# Altium project LEGO_VL53L1X_Sensor.PrjPcb
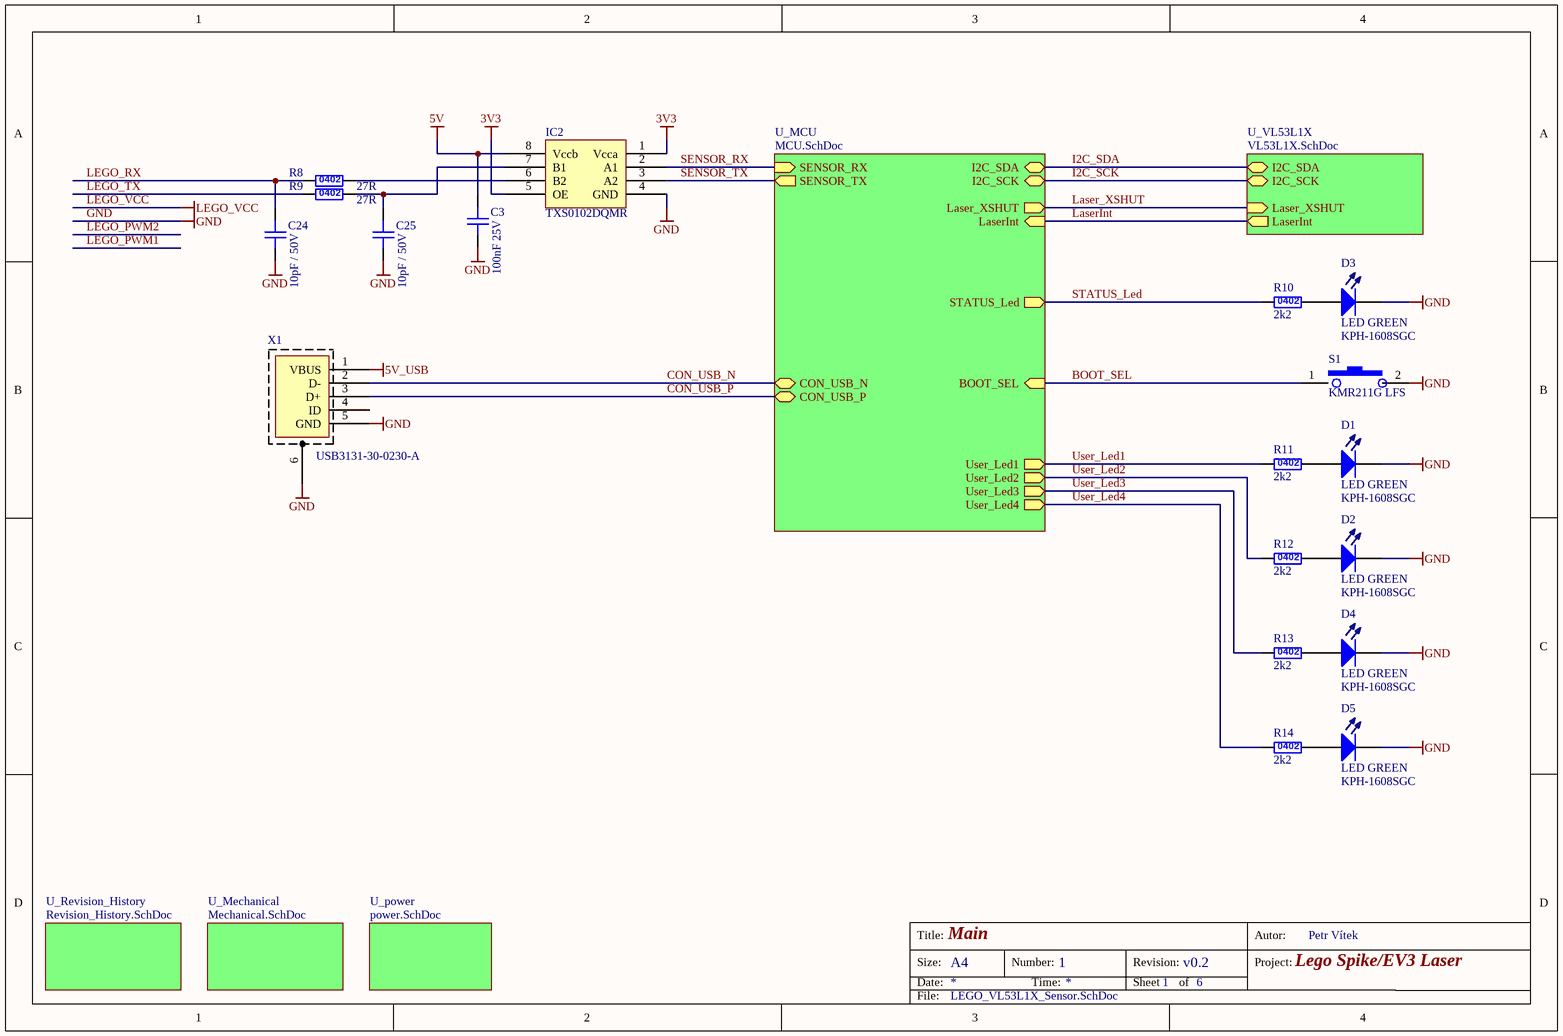
[diagram p0: LEGO_VL53L1X_Sensor.SchDoc]
projectAuthor: Petr Vítek; projectRevision: v0.2; projectTitle: Lego Spike/EV3 Laser
6 sheets, 56 parts. Net scope: hierarchical (ports join the sheet entries above them; power ports are global).
Board file: LEGO_VL53L1X_Sensor.PcbDoc
Sheets:
  LEGO_VL53L1X_Sensor.SchDoc
    U_Revision_History = Revision_History.SchDoc
    U_Mechanical = Mechanical.SchDoc
    U_VL53L1X = VL53L1X.SchDoc
    U_MCU = MCU.SchDoc
    U_power = Power.SchDoc

## Sheet LEGO_VL53L1X_Sensor.SchDoc
size A4; DocumentNumber: 1; SheetNumber: 1; SheetTotal: 6; sheetTitle: Main

### Parts
C3  value 100nF 25V  [C0402]  (hidden comment: UniversalCapacitor)
C24  value 10pF / 50V  [C0402]  (hidden comment: UniversalCapacitor)
C25  value 10pF / 50V  [C0402]  (hidden comment: UniversalCapacitor)
D1  LED GREEN  value KPH-1608SGC  [LED0603]
D2  LED GREEN  value KPH-1608SGC  [LED0603]
D3  LED GREEN  value KPH-1608SGC  [LED0603]
D4  LED GREEN  value KPH-1608SGC  [LED0603]
D5  LED GREEN  value KPH-1608SGC  [LED0603]
IC2  TXS0102DQMR  [X2SON-8_1.8x1.2]
R8  value 27R  [R0402]  (hidden comment: UniversalResistor0402)
R9  value 27R  [R0402]  (hidden comment: UniversalResistor0402)
R10  value 2k2  [R0402]  (hidden comment: UniversalResistor0402)
R11  value 2k2  [R0402]  (hidden comment: UniversalResistor0402)
R12  value 2k2  [R0402]  (hidden comment: UniversalResistor0402)
R13  value 2k2  [R0402]  (hidden comment: UniversalResistor0402)
R14  value 2k2  [R0402]  (hidden comment: UniversalResistor0402)
S1  value KMR211G LFS  [ButtonKMR2]  (hidden comment: PushButton)
X1  value USB3131-30-0230-A  [USB3131-XX-0230-X]  (hidden comment: USB)

### Sub-sheets
U_MCU = MCU.SchDoc: I2C_SDA (bidir), I2C_SCK (bidir), Laser_XSHUT (out), LaserInt (in), SENSOR_TX (out), SENSOR_RX (in), STATUS_Led (out), BOOT_SEL (in), CON_USB_P (bidir), CON_USB_N (bidir), User_Led1 (out), User_Led2 (out), User_Led3 (out), User_Led4 (out)
U_Mechanical = Mechanical.SchDoc: no entries
U_power = power.SchDoc: no entries
U_Revision_History = Revision_History.SchDoc: no entries
U_VL53L1X = VL53L1X.SchDoc: Laser_XSHUT (in), LaserInt (out), I2C_SDA (bidir), I2C_SCK (bidir)

### Nets
3V3: IC2.1(Vcca) IC2.5(OE)
5V: C3.2 IC2.8(Vccb)
5V_USB: X1.1(VBUS)
GND: C3.1 C24.2 C25.2 D1.2(K) D2.2(K) D3.2(K) D4.2(K) D5.2(K) IC2.4(GND) S1.2 X1.5(GND) X1.6
BOOT_SEL: S1.1 ; sheet U_MCU/BOOT_SEL
CON_USB_N: X1.2(D-) ; sheet U_MCU/CON_USB_N
CON_USB_P: X1.3(D+) ; sheet U_MCU/CON_USB_P
I2C_SCK: sheet U_VL53L1X/I2C_SCK, sheet U_MCU/I2C_SCK
I2C_SDA: sheet U_VL53L1X/I2C_SDA, sheet U_MCU/I2C_SDA
Laser_XSHUT: sheet U_VL53L1X/Laser_XSHUT, sheet U_MCU/Laser_XSHUT
LaserInt: sheet U_VL53L1X/LaserInt, sheet U_MCU/LaserInt
LEGO_RX: C24.1 R8.2
LEGO_TX: R9.2
SENSOR_RX: IC2.2(A1) ; sheet U_MCU/SENSOR_RX
SENSOR_TX: IC2.3(A2) ; sheet U_MCU/SENSOR_TX
STATUS_Led: R10.2 ; sheet U_MCU/STATUS_Led
User_Led1: R11.2 ; sheet U_MCU/User_Led1
User_Led2: R12.2 ; sheet U_MCU/User_Led2
User_Led3: R13.2 ; sheet U_MCU/User_Led3
User_Led4: R14.2 ; sheet U_MCU/User_Led4
NetC25_1: C25.1 IC2.7(B1) R9.1
NetD1_1: D1.1(A) R11.1
NetD2_1: D2.1(A) R12.1
NetD3_1: D3.1(A) R10.1
NetD4_1: D4.1(A) R13.1
NetD5_1: D5.1(A) R14.1
NetIC2_6: IC2.6(B2) R8.1

Not connected (* = marked no-connect by the designer): X1 4(ID)

### Notes on the sheet
- Title:
- Size:
- Date:
- A4
- Number:
- Time:
- Revision:
- Sheet
- of
- Autor:
- Project:
- File:
- (in symbol CRCW04022K20FKED) 0402
- (in symbol CRCW040227R0FKED) 0402

### Library data of the parts
C3 = 0402B104K250CT: WALSIN - 0402B104K250CT - CAPACITOR, MLCC, X7R, 0.1UF, 25V, 0402; part_id: 2099; name: 0402B104K250CT; Supplier 1: Farnell; Supplier Part Number 1: 2496772; ComponentLink1URL: http://cz.farnell.com/2496772?Ntt=2496772; HelpURL: http://www.farnell.com/datasheets/2340522.pdf; footprint_name: C0402; schematic_name: UniversalCapacitor
C24 C25 = C0402C100D5GAC: Kategorie produktu:	Vícevrstvé keramické kondenzátory MLCC – pro povrchovou montáž SMD, SMT / Výrobce:	KEMET / RoHS::	V souladu RoHS Údaje / Série:	C-C / Kapacita:	10 pF / Jmenovité napětí (DC) stejnosměrného proudu	:	50 VDC / Dielektrikum:	C0G (NP0) / Tolerance:	0.5 pF / Kód pouzdra - palce:	0402 / Kód pouzdra - mm:	1005 / Výška:	- / Maximální provozní teplota:	+ 125 C / Minimální provozní teplota:	- 55 C / Koncovka:	- / Výrobek:	General Type MLCCs / Obal:	Cut Tape / Obal:	MouseReel / Obal:	Ree; part_id: 2258; name: C0402C100D5GAC; Supplier 1: Mouser; Supplier Part Number 1: 80-C0402C100D5GAC; ComponentLink1URL: https://cz.mouser.com/ProductDetail/KEMET/C0402C100D5GAC/?qs=sGAEpiMZZMu0f%252bT2bkVfuj0aSb%252bMTiHU; HelpURL: http://www.mouser.com/ds/2/212/KEM_C1003_C0G_SMD-1101588.pdf; footprint_name: C0402; schematic_name: UniversalCapacitor
D1-D5 = KPH-1608SGC: KINGBRIGHT - KPH-1608SGC - LED, GREEN, 12MCD, 568NM, SMD LED 0603 zelená; part_id: 980; name: KPH-1608SGC; Supplier 1: Farnell; Supplier Part Number 1: 2426215; ComponentLink1URL: http://cz.farnell.com/2426215?Ntt=2426215; HelpURL: http://www.farnell.com/datasheets/1821279.pdf; footprint_name: LED0603; schematic_name: LED
IC2 = TXS0102DQMR: TEXAS INSTRUMENTS - TXS0102DQMR - Voltage Level Translator, 2 Inputs, 4.2ns, 1.65V to 5.5V, X2SON-8; part_id: 2969; name: TXS0102DQMR; Value: TXS0102DQMR; Supplier 1: Farnell; Supplier Part Number 1: 3050430; ComponentLink1URL: http://cz.farnell.com/3050430?Ntt=3050430; footprint_name: X2SON-8_1.8x1.2; schematic_name: TXS0102DQMR
R8 R9 = CRCW040227R0FKED: VISHAY - CRCW040227R0FKED. - SMD Chip Resistor, 27 ohm, ± 1%, 62.5 mW, 0402 [1005 Metric], Thick Film, General Purpose; name: CRCW040227R0FKED; Supplier 1: Farnell; Supplier Part Number 1: 2140614; ComponentLink1URL: http://cz.farnell.com/2140614?Ntt=2140614; HelpURL: http://www.farnell.com/datasheets/2310790.pdf
R10-R14 = CRCW04022K20FKED: VISHAY - CRCW04022K20FKED. - RES, THICK FILM, 2K2, 1%, 0.063W, 0402; name: CRCW04022K20FKED; Supplier 1: Farnell; Supplier Part Number 1: 2140802; ComponentLink1URL: http://cz.farnell.com/2140802?Ntt=2140802; HelpURL: http://www.farnell.com/datasheets/2310790.pdf
S1 = KMR211G LFS: C & K COMPONENTS - KMR211G LFS - SWITCH, SPST, 0.05A, 32VDC, SMD; part_id: 1256; name: KMR211G LFS; Supplier 1: Farnell; Supplier Part Number 1: 1437635; ComponentLink1URL: http://cz.farnell.com/1437635?Ntt=1437635; HelpURL: http://www.farnell.com/datasheets/1697814.pdf; footprint_name: ButtonKMR2; schematic_name: PushButton
X1 = USB3131-30-0230-A: GCT (GLOBAL CONNECTOR TECHNOLOGY) - USB3131-30-0230-A - USB Connector, Micro USB Type B, USB 2.0, Receptacle, 5 Ways, Through Hole Mount, Vertical; part_id: 2968; Supplier 1: Farnell; ComponentLink1URL: http://cz.farnell.com/2537022?Ntt=2537022; ComponentLink1Description: http://www.farnell.com/datasheets/1359588.pdf; ComponentLink2URL: http://www.adam-tech.com/rick/FinalSingle/CatPg133-134.pdf; ComponentLink2Description: http://www.adam-tech.com/rick/FinalSingle/CatPg133-134.pdf; Pricing: 1=20,954, 100=15,959, 250=14,315, 500=13,066, 1000=12,031 (EUR); Supplier Part Number 1: 2537022; name: USB3131-30-0230-A; HelpURL: http://www.farnell.com/datasheets/2342944.pdf; footprint_name: USB3131-XX-0230-X; schematic_name: MUSB

## Sheet Revision_History.SchDoc
size A4; DocumentNumber: 5; SheetNumber: 5; SheetTotal: 6; PageSetup: Record=PageOptions|CenterHorizontal=True|CenterVertical=True|PrintScale=0.73|XCorrection=1.00|YCorrection=1.00|PrintKind=0|BorderSize=5000000|LeftOffset=0|BottomOffset=0|Orientation=2|PaperLength=1000|PaperWidth=1000|Scale=100|PaperSource=7|PrintQuality=-4|MediaType=1|DitherType=10|PaperKind=A4|PrintScaleMode=1; sheetTitle: Revision history
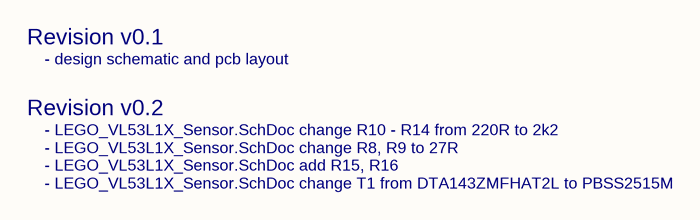
[diagram p1: Revision_History.SchDoc]

### Notes on the sheet
- Revision v0.1
- - design schematic and pcb layout
- Revision v0.2
- - LEGO_VL53L1X_Sensor.SchDoc change R10 - R14 from 220R to 2k2
- - LEGO_VL53L1X_Sensor.SchDoc change R8, R9 to 27R
- - LEGO_VL53L1X_Sensor.SchDoc add R15, R16
- - LEGO_VL53L1X_Sensor.SchDoc change T1 from DTA143ZMFHAT2L to PBSS2515M
- Title:
- Size:
- Date:
- A4
- Number:
- Time:
- Revision:
- Sheet
- of
- Autor:
- Project:
- File:

## Sheet Mechanical.SchDoc
size A4; DocumentNumber: 6; SheetNumber: 6; SheetTotal: 6; sheetTitle: Mechanical

### Notes on the sheet
- Title:
- Size:
- Date:
- A4
- Number:
- Time:
- Revision:
- Sheet
- of
- Autor:
- Project:
- File:

## Sheet VL53L1X.SchDoc
size A4; DocumentNumber: 2; SheetNumber: 2; SheetTotal: 6; sheetTitle: VL53L1X Sensor
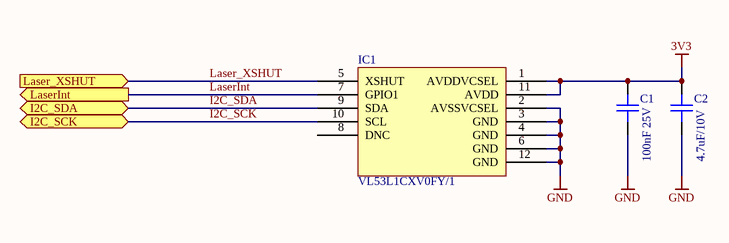
[diagram p2: VL53L1X.SchDoc]

### Parts
C1  value 100nF 25V  [C0402]  (hidden comment: UniversalCapacitor)
C2  4.7uF/10V  [C0402_big]
IC1  value VL53L1CXV0FY/1  [VL53L1X]  (hidden comment: VL53L1X)

### Ports
I2C_SCK (bidir), I2C_SDA (bidir), Laser_XSHUT (in), LaserInt (out)

### Nets
3V3: C1.2 C2.1 IC1.1(AVDDVCSEL) IC1.11(AVDD)
GND: C1.1 C2.2 IC1.2(AVSSVCSEL) IC1.3(GND) IC1.4(GND) IC1.6(GND) IC1.12(GND)
I2C_SCK: IC1.10(SCL) ; port I2C_SCK
I2C_SDA: IC1.9(SDA) ; port I2C_SDA
Laser_XSHUT: IC1.5(XSHUT) ; port Laser_XSHUT
LaserInt: IC1.7(GPIO1) ; port LaserInt

Not connected (* = marked no-connect by the designer): IC1 8(DNC)

### Notes on the sheet
- Title:
- Size:
- Date:
- A4
- Number:
- Time:
- Revision:
- Sheet
- of
- Autor:
- Project:
- File:

### Library data of the parts
C1 = 0402B104K250CT: as C3 on sheet LEGO_VL53L1X_Sensor; name: 0402B104K250CT; Supplier 1: Farnell; Supplier Part Number 1: 2496772; ComponentLink1URL: http://cz.farnell.com/2496772?Ntt=2496772; HelpURL: http://www.farnell.com/datasheets/2340522.pdf; footprint_name: C0402; schematic_name: UniversalCapacitor
C2 = GRM155R61A475MEAAD: MURATA - GRM155R61A475MEAAD - CAP, MLCC, X5R, 4.7UF, 10V, 0402; part_id: 2175; Value: 4.7uF/10V; name: GRM155R61A475MEAAD; Supplier 1: Farnell; Supplier Part Number 1: 2688503; ComponentLink1URL: http://cz.farnell.com/2688503?Ntt=2688503; HelpURL: http://www.farnell.com/datasheets/2189109.pdf; footprint_name: C0402_big; schematic_name: UniversalCapacitor
IC1 = VL53L1CXV0FY/1: STMICROELECTRONICS - VL53L1CXV0FY/1 - Proximity Sensor, I2C, 4000 mm, OLGA, 12 Pins, 2.6 V, 3.5 V; part_id: 2672; name: VL53L1CXV0FY/1; Supplier 1: Farnell; Supplier Part Number 1: 2851946; ComponentLink1URL: http://cz.farnell.com/2851946?Ntt=2851946; HelpURL: http://www.farnell.com/datasheets/2600105.pdf; footprint_name: VL53L1X; schematic_name: VL53L1X

## Sheet MCU.SchDoc
size A4; DocumentNumber: 3; SheetNumber: 3; SheetTotal: 6; sheetTitle: MCU
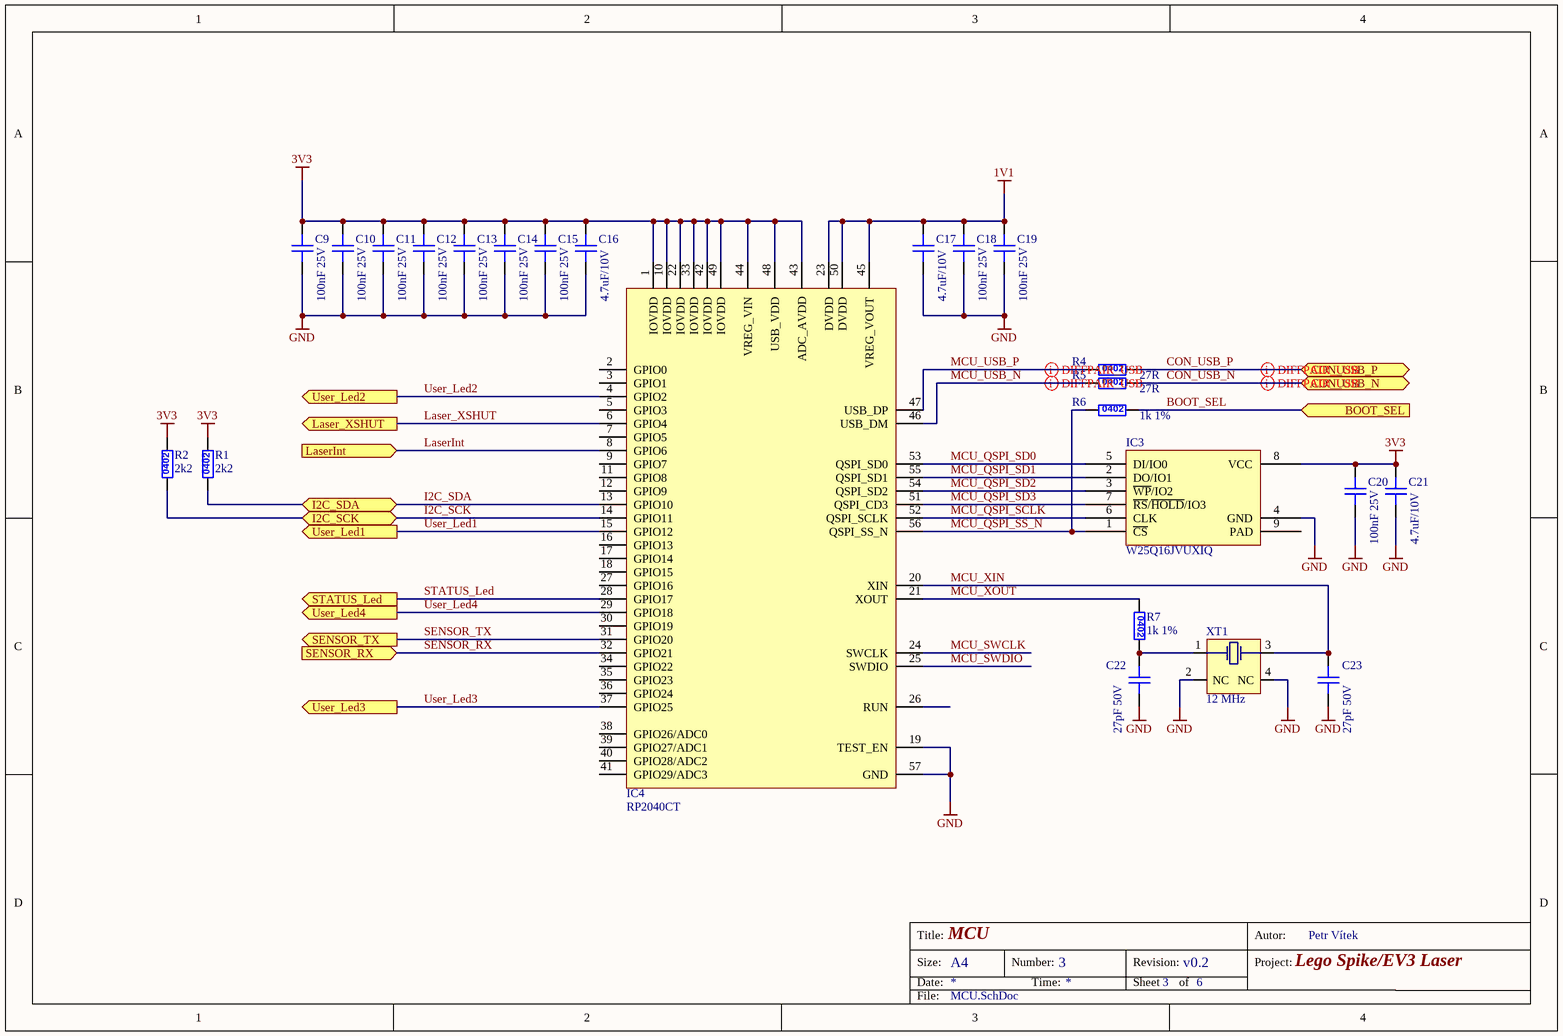
[diagram p3: MCU.SchDoc]

### Parts
C9  value 100nF 25V  [C0402]  (hidden comment: UniversalCapacitor)
C10  value 100nF 25V  [C0402]  (hidden comment: UniversalCapacitor)
C11  value 100nF 25V  [C0402]  (hidden comment: UniversalCapacitor)
C12  value 100nF 25V  [C0402]  (hidden comment: UniversalCapacitor)
C13  value 100nF 25V  [C0402]  (hidden comment: UniversalCapacitor)
C14  value 100nF 25V  [C0402]  (hidden comment: UniversalCapacitor)
C15  value 100nF 25V  [C0402]  (hidden comment: UniversalCapacitor)
C16  4.7uF/10V  [C0402_big]
C17  4.7uF/10V  [C0402_big]
C18  value 100nF 25V  [C0402]  (hidden comment: UniversalCapacitor)
C19  value 100nF 25V  [C0402]  (hidden comment: UniversalCapacitor)
C20  value 100nF 25V  [C0402]  (hidden comment: UniversalCapacitor)
C21  4.7uF/10V  [C0402_big]
C22  value 27pF 50V  [C0402]  (hidden comment: UniversalCapacitor)
C23  value 27pF 50V  [C0402]  (hidden comment: UniversalCapacitor)
IC3  value W25Q16JVUXIQ  [USON-8_3x2]  (hidden comment: W25Q16JV)
IC4  value RP2040CT  [QFN56]  (hidden comment: RP2040)
R1  value 2k2  [R0402]  (hidden comment: UniversalResistor0402)
R2  value 2k2  [R0402]  (hidden comment: UniversalResistor0402)
R4  value 27R  [R0402]  (hidden comment: UniversalResistor0402)
R5  value 27R  [R0402]  (hidden comment: UniversalResistor0402)
R6  value 1k 1%  [R0402]  (hidden comment: UniversalResistor0402)
R7  value 1k 1%  [R0402]  (hidden comment: UniversalResistor0402)
XT1  value 12 MHz  [ABM8]  (hidden comment: XTAL-4Pads-2Used)

### Ports
BOOT_SEL (in), CON_USB_N (bidir), CON_USB_P (bidir), I2C_SCK (bidir), I2C_SDA (bidir), Laser_XSHUT (out), LaserInt (in), SENSOR_RX (in), SENSOR_TX (out), STATUS_Led (out), User_Led1 (out), User_Led2 (out), User_Led3 (out), User_Led4 (out)

### Nets
1V1: C17.1 C18.2 C19.2 IC4.23(DVDD) IC4.45(VREG_VOUT) IC4.50(DVDD)
3V3: C9.2 C10.2 C11.2 C12.2 C13.2 C14.2 C15.2 C16.1 C20.2 C21.1 IC3.8(VCC) IC4.1(IOVDD) IC4.10(IOVDD) IC4.22(IOVDD) IC4.33(IOVDD) IC4.42(IOVDD) IC4.43(ADC_AVDD) IC4.44(VREG_VIN) IC4.48(USB_VDD) IC4.49(IOVDD) R1.1 R2.1
GND: C9.1 C10.1 C11.1 C12.1 C13.1 C14.1 C15.1 C16.2 C17.2 C18.1 C19.1 C20.1 C21.2 C22.2 C23.2 IC3.4(GND) IC4.19(TEST_EN) IC4.57(GND) XT1.2(NC) XT1.4(NC)
BOOT_SEL: R6.1 ; port BOOT_SEL
CON_USB_N: R5.1 ; port CON_USB_N
CON_USB_P: R4.1 ; port CON_USB_P
I2C_SCK: IC4.14(GPIO11) R2.2 ; port I2C_SCK
I2C_SDA: IC4.13(GPIO10) R1.2 ; port I2C_SDA
Laser_XSHUT: IC4.6(GPIO4) ; port Laser_XSHUT
LaserInt: IC4.8(GPIO6) ; port LaserInt
MCU_QSPI_SCLK: IC3.6(CLK) IC4.52(QSPI_SCLK)
MCU_QSPI_SD0: IC3.5(DI/IO0) IC4.53(QSPI_SD0)
MCU_QSPI_SD1: IC3.2(DO/IO1) IC4.55(QSPI_SD1)
MCU_QSPI_SD2: IC3.3(~{WP}/IO2) IC4.54(QSPI_SD2)
MCU_QSPI_SD3: IC3.7(~{RS}/~{HOLD}/IO3) IC4.51(QSPI_CD3)
MCU_QSPI_SS_N: IC3.1(~{CS}) IC4.56(QSPI_SS_N) R6.2
MCU_SWCLK: IC4.24(SWCLK)
MCU_SWDIO: IC4.25(SWDIO)
MCU_USB_N: IC4.46(USB_DM) R5.2
MCU_USB_P: IC4.47(USB_DP) R4.2
MCU_XIN: C23.1 IC4.20(XIN) XT1.3
MCU_XOUT: IC4.21(XOUT) R7.2
SENSOR_RX: IC4.32(GPIO21) ; port SENSOR_RX
SENSOR_TX: IC4.31(GPIO20) ; port SENSOR_TX
STATUS_Led: IC4.28(GPIO17) ; port STATUS_Led
User_Led1: IC4.15(GPIO12) ; port User_Led1
User_Led2: IC4.4(GPIO2) ; port User_Led2
User_Led3: IC4.37(GPIO25) ; port User_Led3
User_Led4: IC4.29(GPIO18) ; port User_Led4
NetC22_1: C22.1 R7.1 XT1.1

Not connected (* = marked no-connect by the designer): IC3 9(PAD); IC4 2(GPIO0) 3(GPIO1) 5(GPIO3) 7(GPIO5) 9(GPIO7) 11(GPIO8) 12(GPIO9) 16(GPIO13) 17(GPIO14) 18(GPIO15) 26(RUN) 27(GPIO16) 30(GPIO19) 34(GPIO22) 35(GPIO23) 36(GPIO24) 38(GPIO26/ADC0) 39(GPIO27/ADC1) 40(GPIO28/ADC2) 41(GPIO29/ADC3)

### Layout directives
differential pair; differential pair class diff_90ohm; net class single_50ohm; Parameter 1: DIFF_USB: CON_USB_N, CON_USB_P, MCU_USB_N, MCU_USB_P

### Notes on the sheet
- Title:
- Size:
- Date:
- A4
- Number:
- Time:
- Revision:
- Sheet
- of
- Autor:
- Project:
- File:
- (in symbol CRCW04021K00FKED) 0402
- (in symbol CRCW04022K20FKED) 0402
- (in symbol CRCW040227R0FKED) 0402

### Library data of the parts
C9-C15 C18-C20 = 0402B104K250CT: as C3 on sheet LEGO_VL53L1X_Sensor; name: 0402B104K250CT; Supplier 1: Farnell; Supplier Part Number 1: 2496772; ComponentLink1URL: http://cz.farnell.com/2496772?Ntt=2496772; HelpURL: http://www.farnell.com/datasheets/2340522.pdf; footprint_name: C0402; schematic_name: UniversalCapacitor
C16 C17 C21 = GRM155R61A475MEAAD: as C2 on sheet VL53L1X; Value: 4.7uF/10V; name: GRM155R61A475MEAAD; Supplier 1: Farnell; Supplier Part Number 1: 2688503; ComponentLink1URL: http://cz.farnell.com/2688503?Ntt=2688503; HelpURL: http://www.farnell.com/datasheets/2189109.pdf; footprint_name: C0402_big; schematic_name: UniversalCapacitor
C22 C23 = 0402N270J500CT: WALSIN - 0402N270J500CT - CAPACITOR, MLCC, NP0, 27PF, 50V, 0402; part_id: 2100; name: 0402N270J500CT; Supplier 1: Farnell; Supplier Part Number 1: 2496801; ComponentLink1URL: http://cz.farnell.com/2496801?Ntt=2496801; HelpURL: http://www.farnell.com/datasheets/2340522.pdf; footprint_name: C0402; schematic_name: UniversalCapacitor
IC3 = W25Q16JVUXIQ: Flash NOR spiFlash, 3V, 16M-bit, 4Kb Uniform Sector, DTR; part_id: 2967; name: W25Q16JVUXIQ; Supplier 1: Mouser; Supplier Part Number 1: 454-W25Q16JVUXIQTR; ComponentLink1URL: https://cz.mouser.com/ProductDetail/Winbond/W25Q16JVUXIQ-TR?qs=qSfuJ%252Bfl%2Fd7SDdIHLGOd1g%3D%3D; HelpURL: https://cz.mouser.com/datasheet/2/949/w25q16jv_spi_revg_03222018_plus-1489727.pdf; footprint_name: USON-8_3x2; schematic_name: W25Q16JVUXIQ
IC4 = RP2040CT: RASPBERRY-PI - RP2040CT - ARM MCU, RP2040 Series Microcontrollers, ARM Cortex-M0+, 32bit, 133 MHz, 16 MB, 264 KB; part_id: 2966; name: RP2040CT; Supplier 1: Farnell; Supplier Part Number 1: 3766082; ComponentLink1URL: http://cz.farnell.com/3766082?Ntt=3766082; HelpURL: http://www.farnell.com/datasheets/3213406.pdf; footprint_name: QFN56; schematic_name: RP2040
R1 R2 = CRCW04022K20FKED: VISHAY - CRCW04022K20FKED. - RES, THICK FILM, 2K2, 1%, 0.063W, 0402; part_id: 2177; name: CRCW04022K20FKED; Supplier 1: Farnell; Supplier Part Number 1: 2140802; ComponentLink1URL: http://cz.farnell.com/2140802?Ntt=2140802; HelpURL: http://www.farnell.com/datasheets/2310790.pdf; footprint_name: R0402; schematic_name: UniversalResistor0402
R4 R5 = CRCW040227R0FKED: VISHAY - CRCW040227R0FKED. - SMD Chip Resistor, 27 ohm, ± 1%, 62.5 mW, 0402 [1005 Metric], Thick Film, General Purpose; part_id: 2830; name: CRCW040227R0FKED; Supplier 1: Farnell; Supplier Part Number 1: 2140614; ComponentLink1URL: http://cz.farnell.com/2140614?Ntt=2140614; HelpURL: http://www.farnell.com/datasheets/2310790.pdf; footprint_name: R0402; schematic_name: UniversalResistor0402
R6 R7 = CRCW04021K00FKED: VISHAY - CRCW04021K00FKED - RES, THICK FILM, 1K, 1%, 0.063W, 0402; part_id: 2180; name: CRCW04021K00FKED; Supplier 1: Farnell; Supplier Part Number 1: 1469662; ComponentLink1URL: http://cz.farnell.com/1469662?Ntt=1469662; HelpURL: http://www.farnell.com/datasheets/2310790.pdf; footprint_name: R0402; schematic_name: UniversalResistor0402
XT1 = ABM8-12.000MHZ-B2-T: Krystaly 12.0 MHZ 18PF 20PPM 120OHM; part_id: 1039; name: ABM8-12.000MHZ-B2-T; Supplier 1: Mouser; Supplier Part Number 1: 815-ABM8-12-B2-T; ComponentLink1URL: https://cz.mouser.com/ProductDetail/ABRACON/ABM8-12.000MHZ-B2-T?qs=hjiqo2PPvpiyy6%252BNWm3IZg%3D%3D; HelpURL: https://cz.mouser.com/datasheet/2/3/abm8-1384678.pdf; footprint_name: ABM8; schematic_name: XTAL-4Pads-2Used

## Sheet Power.SchDoc
size A4; DocumentNumber: 4; SheetNumber: 4; SheetTotal: 6; sheetTitle: E-ink display
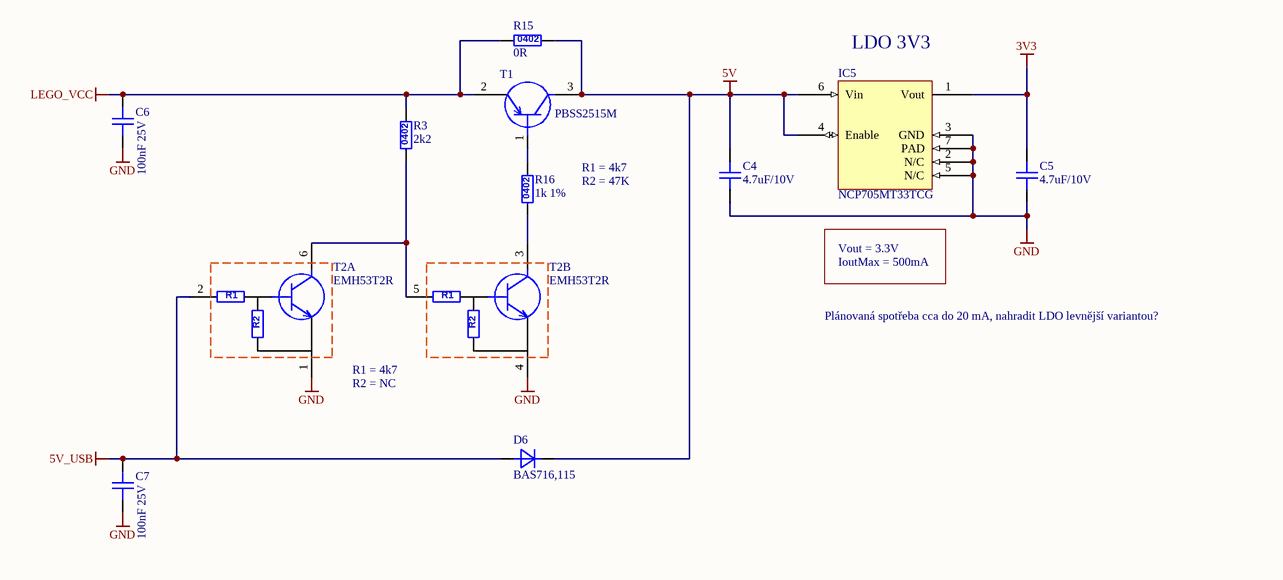
[diagram p4: Power.SchDoc]

### Parts
C4  value 4.7uF/10V  [C0402_big]  (hidden comment: UniversalCapacitor)
C5  value 4.7uF/10V  [C0402_big]  (hidden comment: UniversalCapacitor)
C6  value 100nF 25V  [C0402]  (hidden comment: UniversalCapacitor)
C7  value 100nF 25V  [C0402]  (hidden comment: UniversalCapacitor)
D6  value BAS716,115  [SOD523]  (hidden comment: Diode)
IC5  value NCP705MT33TCG  [WDFN6]  (hidden comment: VoltageRegulator-Fixed08)
R3  value 2k2  [R0402]  (hidden comment: UniversalResistor0402)
R15  value 0R  [R0402]  (hidden comment: UniversalResistor0402)
R16  value 1k 1%  [R0402]  (hidden comment: UniversalResistor0402)
T1  value PBSS2515M  [DFN1006-3]  (hidden comment: PNP)
T2  value EMH53T2R  [SOT-563-6]  (hidden comment: NPN_DUAL)  (parts A,B of 2)

### Nets
3V3: C5.1 IC5.1(Vout)
5V: C4.1 D6.2(C) IC5.4(Enable) IC5.6(Vin) R15.1 T1.3(C)
5V_USB: C7.2 D6.1(A) T2.2(E)
GND: C4.2 C5.2 C6.1 C7.1 IC5.2(N/C) IC5.3(GND) IC5.5(N/C) IC5.7(PAD) T2.1(B) T2.4(e)
LEGO_VCC: C6.2 R3.1 R15.2 T1.2(E)
NetR3_2: R3.2 T2.5(E) T2.6(C)
NetR16_1: R16.1 T1.1(B)
NetR16_2: R16.2 T2.3(C)

### Notes on the sheet
- (near IC5) LDO 3V3
- R1 = 4k7
- R2 = 47K
- Vout = 3.3V
- IoutMax = 500mA
- (near T2) R1 = 4k7
- Plánovaná spotřeba cca do 20 mA, nahradit LDO levnější variantou?
- (near T2) R2 = NC
- Title:
- Size:
- Date:
- A4
- Number:
- Time:
- Revision:
- Sheet
- of
- Autor:
- Project:
- File:
- (in symbol CRCW04021K00FKED) 0402
- (in symbol CRCW04022K20FKED) 0402
- (in symbol CRCW04020000Z0ED) 0402
- (in symbol EMH53T2R, part A) R1; R2
- (in symbol EMH53T2R, part B) R1; R2

### Library data of the parts
C4 C5 = GRM155R61A475MEAAD: as C2 on sheet VL53L1X; name: GRM155R61A475MEAAD; Supplier 1: Farnell; Supplier Part Number 1: 2688503; ComponentLink1URL: http://cz.farnell.com/2688503?Ntt=2688503; HelpURL: http://www.farnell.com/datasheets/2189109.pdf; footprint_name: C0402_big; schematic_name: UniversalCapacitor
C6 C7 = 0402B104K250CT: as C3 on sheet LEGO_VL53L1X_Sensor; name: 0402B104K250CT; Supplier 1: Farnell; Supplier Part Number 1: 2496772; ComponentLink1URL: http://cz.farnell.com/2496772?Ntt=2496772; HelpURL: http://www.farnell.com/datasheets/2340522.pdf; footprint_name: C0402; schematic_name: UniversalCapacitor
D6 = BAS716,115: NEXPERIA - BAS716,115 - Small Signal Diode, Single, 85 V, 200 mA, 1.25 V, 3 µs, 4 A; part_id: 2944; name: BAS716,115; Supplier 1: Farnell; Supplier Part Number 1: 8734500; ComponentLink1URL: http://cz.farnell.com/8734500?Ntt=8734500; HelpURL: http://www.farnell.com/datasheets/674433.pdf; footprint_name: SOD523; schematic_name: Diode
IC5 = NCP705MT33TCG: Regulátory napětí s nízkým úbytkem (LDO) 500 MA LDO ULTRA-LOW IQ; part_id: 2970; name: NCP705MT33TCG; Supplier 1: Mouser; Supplier Part Number 1: 863-NCP705MT33TCG; ComponentLink1URL: https://cz.mouser.com/ProductDetail/onsemi/NCP705MT33TCG?qs=l5F7KFZg3O5BAqXCIJeMgQ%3D%3D; HelpURL: https://cz.mouser.com/datasheet/2/308/NCP705_D-1812761.pdf; footprint_name: WDFN6; schematic_name: VoltageRegulator-Fixed08
R3 = CRCW04022K20FKED: as R1 on sheet MCU; name: CRCW04022K20FKED; Supplier 1: Farnell; Supplier Part Number 1: 2140802; ComponentLink1URL: http://cz.farnell.com/2140802?Ntt=2140802; HelpURL: http://www.farnell.com/datasheets/2310790.pdf; footprint_name: R0402; schematic_name: UniversalResistor0402
R15 = CRCW04020000Z0ED: VISHAY - CRCW04020000Z0ED - RESISTOR, 0R, 0.063W, JUMPER, 0402, SMD; name: CRCW04020000Z0ED; Supplier 1: Farnell; Supplier Part Number 1: 1469661; ComponentLink1URL: http://cz.farnell.com/1469661?Ntt=1469661; HelpURL: http://www.farnell.com/datasheets/2310790.pdf
R16 = CRCW04021K00FKED: as R6 on sheet MCU; name: CRCW04021K00FKED; Supplier 1: Farnell; Supplier Part Number 1: 1469662; ComponentLink1URL: http://cz.farnell.com/1469662?Ntt=1469662; HelpURL: http://www.farnell.com/datasheets/2310790.pdf; footprint_name: R0402; schematic_name: UniversalResistor0402
T1 = PBSS2515M,315: NEXPERIA - PBSS2515M,315 - TRANSISTOR, BIPOLAR; name: PBSS2515M,315; Supplier 1: Mouser; Supplier Part Number 1: 771-PBSS2515M315; ComponentLink1URL: https://cz.mouser.com/ProductDetail/Nexperia/PBSS2515M315?qs=LOCUfHb8d9svQrHgrvn9Qw%3D%3D; HelpURL: https://4donline.ihs.com/images/VipMasterIC/IC/PIRS/PIRSS00607/PIRSS00607-1.pdf?hkey=6D3A4C79FDBF58556ACFDE234799DDF0
T2 = EMH53T2R: ROHM - EMH53T2R - Bipolar Pre-Biased / Digital Transistor, Dual NPN, 50 V, 100 mA, 4.7 kohm; part_id: 2971; name: EMH53T2R; Supplier 1: Farnell; Supplier Part Number 1: 3757495; ComponentLink1URL: http://cz.farnell.com/3757495?Ntt=3757495; HelpURL: http://www.farnell.com/datasheets/3209004.pdf; footprint_name: SOT-563-6; schematic_name: NPN_DUAL

## Nets that join several sheets
3V3: LEGO_VL53L1X_Sensor (IC2.1 IC2.5), VL53L1X (C1.2 C2.1 IC1.1 IC1.11), MCU (22 pins), Power (C5.1 IC5.1)
5V: LEGO_VL53L1X_Sensor (C3.2 IC2.8), Power (6 pins)
5V_USB: LEGO_VL53L1X_Sensor (X1.1), Power (C7.2 D6.1 T2.2)
GND: LEGO_VL53L1X_Sensor (12 pins), VL53L1X (7 pins), MCU (20 pins), Power (10 pins)
BOOT_SEL: LEGO_VL53L1X_Sensor (S1.1), MCU (R6.1)
CON_USB_N: LEGO_VL53L1X_Sensor (X1.2), MCU (R5.1)
CON_USB_P: LEGO_VL53L1X_Sensor (X1.3), MCU (R4.1)
I2C_SCK: VL53L1X (IC1.10), MCU (IC4.14 R2.2)
I2C_SDA: VL53L1X (IC1.9), MCU (IC4.13 R1.2)
Laser_XSHUT: VL53L1X (IC1.5), MCU (IC4.6)
LaserInt: VL53L1X (IC1.7), MCU (IC4.8)
SENSOR_RX: LEGO_VL53L1X_Sensor (IC2.2), MCU (IC4.32)
SENSOR_TX: LEGO_VL53L1X_Sensor (IC2.3), MCU (IC4.31)
STATUS_Led: LEGO_VL53L1X_Sensor (R10.2), MCU (IC4.28)
User_Led1: LEGO_VL53L1X_Sensor (R11.2), MCU (IC4.15)
User_Led2: LEGO_VL53L1X_Sensor (R12.2), MCU (IC4.4)
User_Led3: LEGO_VL53L1X_Sensor (R13.2), MCU (IC4.37)
User_Led4: LEGO_VL53L1X_Sensor (R14.2), MCU (IC4.29)

## Assembly variants
default: not fitted R15